# Altium project Carte_Batterie_PAMI 2024.PrjPcb
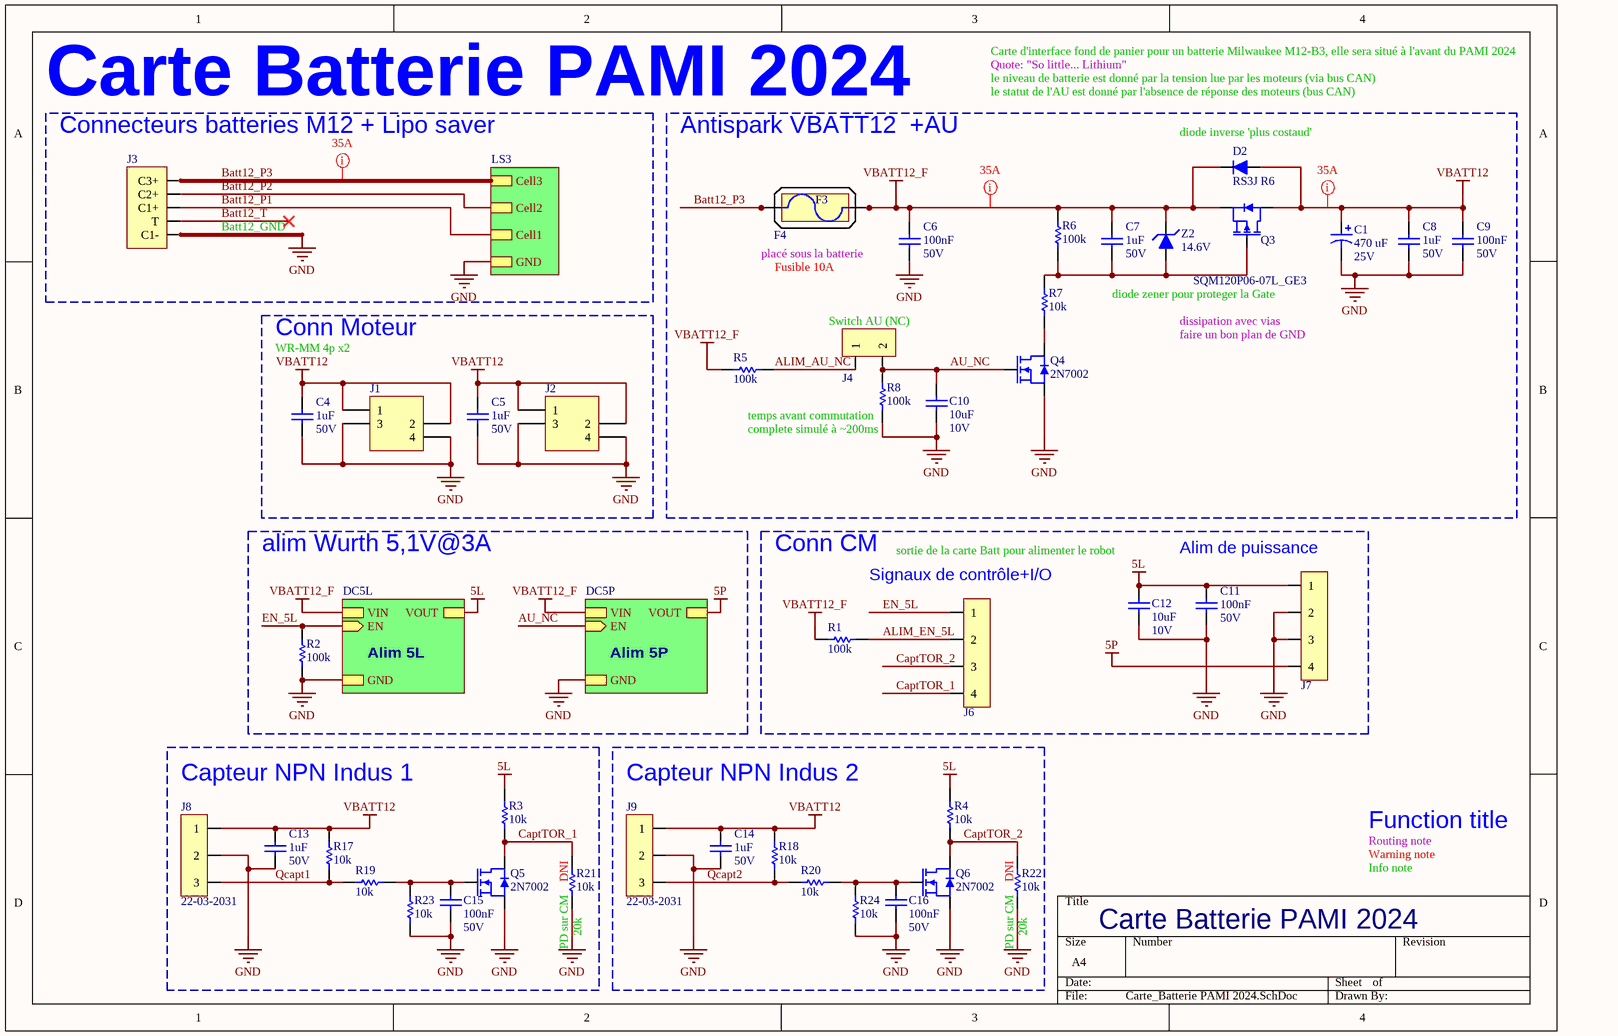
[diagram p0: Carte_Batterie PAMI 2024.SchDoc]
3 sheets, 88 parts. Net scope: hierarchical (ports join the sheet entries above them; power ports are global).
Board file: Carte_Batterie PAMI 2024.PcbDoc
Sheets:
  Carte_Batterie PAMI 2024.SchDoc
    LS3 = Lipo_Saver_Buzzer_only.SchDoc
    DC5L = PWR_5V_3A.SchDoc
    DC5P = PWR_5V_3A.SchDoc

## Sheet Carte_Batterie PAMI 2024.SchDoc
size A4; Author: Audran; CompanyName: Goldorak; Address1: Electrolab; Address2: 52 rue Paul Lescop; Address3: 92000 Nanterre; DocumentNumber: 1; SheetNumber: 1; SheetTotal: 3; ProjectName: Cartes_2017

### Parts
(Parts that share a designator on the sheet are numbered #1, #2 ... from top to bottom, then left to right.)
C1  470 uF  RatedVoltage: 25V  [WCAP-ATG8_8x11.5x3.5x0.5]
C4  1uF  RatedVoltage: 50V  [WCAP-CSGP_0805, 2x1.25x1.25]
C5  1uF  RatedVoltage: 50V  [WCAP-CSGP_0805, 2x1.25x1.25]
C6  100nF  RatedVoltage: 50V  [WCAP-CSGP_0603, 1.6x0.8x0.8]
C7  1uF  RatedVoltage: 50V  [WCAP-CSGP_0805, 2x1.25x1.25]
C8  1uF  RatedVoltage: 50V  [WCAP-CSGP_0805, 2x1.25x1.25]
C9  100nF  RatedVoltage: 50V  [WCAP-CSGP_0603, 1.6x0.8x0.8]
C10  10uF  RatedVoltage: 10V  [WCAP-CSGP_0805, 2x1.25x1.25]
C11  100nF  RatedVoltage: 50V  [WCAP-CSGP_0603, 1.6x0.8x0.8]
C12  10uF  RatedVoltage: 10V  [WCAP-CSGP_0805, 2x1.25x1.25]
C13  1uF  RatedVoltage: 50V  [WCAP-CSGP_0805, 2x1.25x1.25]
C14  1uF  RatedVoltage: 50V  [WCAP-CSGP_0805, 2x1.25x1.25]
C15  100nF  RatedVoltage: 50V  [WCAP-CSGP_0603, 1.6x0.8x0.8]
C16  100nF  RatedVoltage: 50V  [WCAP-CSGP_0603, 1.6x0.8x0.8]
D2  RS3J R6  [SMC, DO-214AB]
F3  0891030.NXS  (value not drawn)  (mechanical)
F4  3557-2  [3557-2]  (value not drawn)
J1  690367280476  [690367280476]  (value not drawn)
J2  690367280476  [690367280476]  (value not drawn)
J3  custom connector  [CONN_BATT-M12]  (value not drawn)
J4  22-03-2021  [Conn_22-03-2021]  (value not drawn)
J6  22-03-2041  [Conn_22-03-2041]  (value not drawn)
J7  22-03-2041  [Conn_22-03-2041]  (value not drawn)
J8  22-03-2031  [Conn_22-03-2031]
J9  22-03-2031  [Conn_22-03-2031]
Q3  SQM120P06-07L_GE3  [TO263AB, D2PAK]
Q4  2N7002  [SOT-23]
Q5  2N7002  [SOT-23]
Q6  2N7002  [SOT-23]
R1  value 100k  [RESC1608X06N]  (hidden comment: RC0603FR-07100KL)
R2  value 100k  [RESC1608X06N]  (hidden comment: RC0603FR-07100KL)
R3  value 10k  [RESC1608X06N]  (hidden comment: RC0603FR-0710KL)
R4  value 10k  [RESC1608X06N]  (hidden comment: RC0603FR-0710KL)
R5  value 100k  [RESC1608X06N]  (hidden comment: RC0603FR-07100KL)
R6  value 100k  [RESC1608X06N]  (hidden comment: RC0603FR-07100KL)
R7#1  value 10k  [RESC1608X06N]  (hidden comment: RC0603FR-0710KL)
R8#1  value 100k  [RESC1608X06N]  (hidden comment: RC0603FR-07100KL)
R17  value 10k  [RESC1608X06N]  (hidden comment: RC0603FR-0710KL)
R18  value 10k  [RESC1608X06N]  (hidden comment: RC0603FR-0710KL)
R19  value 10k  [RESC1608X06N]  (hidden comment: RC0603FR-0710KL)
R20  value 10k  [RESC1608X06N]  (hidden comment: RC0603FR-0710KL)
R21  value 10k  [RESC1608X06N]  (hidden comment: RC0603FR-0710KL)
R22  value 10k  [RESC1608X06N]  (hidden comment: RC0603FR-0710KL)
R23  value 10k  [RESC1608X06N]  (hidden comment: RC0603FR-0710KL)
R24  value 10k  [RESC1608X06N]  (hidden comment: RC0603FR-0710KL)
Z2  value 14.6V  [SOD-323]  (hidden comment: MM3Z15VST1G)

### Blocks framed on the sheet
Carte Batterie PAMI 2024: J3
Conn Moteur: C4 C5 J1 J2
alim Wurth 5,1V@3A: R2
Conn CM: C11 C12 J6 J7 R1
Capteur NPN Indus 1: C13 C15 J8 Q5 R3 R17 R19 R21 R23
Capteur NPN Indus 2: C14 C16 J9 Q6 R4 R18 R20 R22 R24

### Sub-sheets
DC5L = PWR_5V_3A.SchDoc: GND, EN (in), VIN, VOUT  | DeviceSheetTitle: Alim 5L
DC5P = PWR_5V_3A.SchDoc: GND, EN (in), VIN, VOUT  | DeviceSheetTitle: Alim 5P
LS3 = Lipo_Saver_Buzzer_only.SchDoc: Cell3, Cell2, Cell1, GND  | DeviceSheetTitle: Device Sheet Title

### Nets
5L: C11.2 C12.2 J7.1 R3.2 R4.2 ; sheet DC5L/VOUT
5P: J7.4 ; sheet DC5P/VOUT
GND: C1.2 C4.1 C5.1 C6.1 C8.1 C9.1 C10.1 C11.1 C12.1 C13.1 C14.1 C15.2 C16.2 J1.3 J1.4 J2.3 J2.4 J3.5(C1-) J7.2 J7.3 J8.2 J9.2 Q4.2(S) Q5.2(S) Q6.2(S) R2.1 R8#1.1 R21.1 R22.1 R23.1 R24.1 ; sheet LS3/GND, sheet DC5L/GND, sheet DC5P/GND
VBATT12: C1.1 C4.2 C5.2 C8.2 C9.2 C13.2 C14.2 D2.1 J1.1 J1.2 J2.1 J2.2 J8.1 J9.1 Q3.4(D) R17.2 R18.2
VBATT12_F: C6.2 C7.2 D2.2 F4.2 F4.4 Q3.3(S) R1.1 R5.1 R6.2 Z2.2 ; sheet DC5L/VIN, sheet DC5P/VIN
ALIM_AU_NC: J4.1 R5.2
ALIM_EN_5L: J6.2 R1.2
AU_NC: C10.2 J4.2 Q4.1(G) R8#1.2 ; sheet DC5P/EN
Batt12_P1: J3.3(C1+) ; sheet LS3/Cell1
Batt12_P2: J3.2(C2+) ; sheet LS3/Cell2
Batt12_P3: F4.1 F4.3 J3.1(C3+) ; sheet LS3/Cell3
Batt12_T: J3.4(T)
CaptTOR_1: J6.4 Q5.3(D) R3.1 R21.2
CaptTOR_2: J6.3 Q6.3(D) R4.1 R22.2
EN_5L: J6.1 R2.2 ; sheet DC5L/EN
Qcapt1: J8.3 R17.1 R19.1
Qcapt2: J9.3 R18.1 R20.1
NetC7_1: C7.1 Q3.1(G) R6.1 R7#1.2 Z2.1
NetC15_1: C15.1 Q5.1(G) R19.2 R23.2
NetC16_1: C16.1 Q6.1(G) R20.2 R24.2
NetQ4_3: Q4.3(D) R7#1.1

### Layout directives
net class PWR_35A: Batt12_P3, VBATT12, VBATT12_F

### Notes on the sheet
- Quote: "So little... Lithium"
- Carte d'interface fond de panier pour un batterie Milwaukee M12-B3, elle sera situé à l'avant du PAMI 2024
- le niveau de batterie est donné par la tension lue par les moteurs (via bus CAN)
- le statut de l'AU est donné par l'absence de réponse des moteurs (bus CAN)
- (near J3) Connecteurs batteries M12 + Lipo saver
- Antispark VBATT12
- +AU
- (near D2) diode inverse 'plus costaud'
- Batt12_GND
- (near C6) placé sous la batterie
- Fusible 10A
- diode zener pour proteger la Gate
- WR-MM 4p x2
- (near J4) Switch AU (NC)
- faire un bon plan de GND
- dissipation avec vias
- (near R8#1) temps avant commutation
- (near R8#1) complete simulé à ~200ms
- (near J6) Signaux de contrôle+I/O
- sortie de la carte Batt pour alimenter le robot
- Alim de puissance
- Routing note
- Function title
- (near R21) DNI
- (near R22) DNI
- Warning note
- Info note
- (near R21) PD sur CM
- (near R21) 20k
- (near R22) PD sur CM
- (near R22) 20k
- Carte Batterie PAMI 2024

### Library data of the parts
C1 = WCAP-ATG8, 860010474013: CAP Alu 470 UF 20% 25 V; Manufacturer: Wurth Elektronik; ComponentLink1Description: Datasheet; ComponentLink1URL: http://katalog.we-online.de/pbs/datasheet/860010474013.pdf; Manufacturer Part Number: 860010474013; Value: 470 uF; Size: 8mmx11.5mm
C4 C5 C7 C8 C13 C14 = WCAP-CSGP, 885012207103: CAP CER 1uF 50V X7R 0805; Manufacturer: Wurth Elektronik; ComponentLink1Description: Datasheet; ComponentLink1URL: http://katalog.we-online.com/pbs/datasheet/885012207103.pdf; Manufacturer Part Number: 885012207103; Value: 1uF; Size: 0805; CeramicType: X7R; Supplier 2: JLCPCB; Supplier Part Number 2: C28323; Supplier Footprint 2: 0805
C6 C9 C11 C15 C16 = WCAP-CSGP, 885012206095: CAP CER 100nF 50V X7R 0603; Manufacturer: Wurth Elektronik; ComponentLink1Description: Datasheet; ComponentLink1URL: http://katalog.we-online.com/pbs/datasheet/885012206095.pdf; Value: 100nF; Size: 0603; CeramicType: X7R; Manufacturer Part Number: 885012206095; Supplier 2: JLCPCB; Supplier Part Number 2: C14663; Supplier Footprint 2: 0603
C10 C12 = WCAP-CSGP, 885012207026: CAP CER 10uF 10V X7R 0805; Manufacturer: Wurth Elektronik; ComponentLink1Description: Datasheet; ComponentLink1URL: http://katalog.we-online.com/pbs/datasheet/885012207026.pdf; Manufacturer Part Number: 885012207026; Value: 10uF; Size: 0805; CeramicType: X7R; Supplier 1: Farnell; Supplier Part Number 1: 2495189; Supplier Part Number 2: C15850; Supplier 2: JLCPCB; Supplier Footprint 2: 0805
D2 = RS3J_R6: DIODE GEN PURP 600V 3A SMC; Manufacturer: TAIWAN SEMICONDUCTOR; Type: Standard; Manufacturer Part Number: RS3J R6; ContinuousForwardCurrent: 3A; Supplier 1: Farnell; Supplier Part Number 1: 2677388; ComponentLink1Description: Datasheet; ComponentLink1URL: http://www.farnell.com/datasheets/2182655.pdf; Value: 600V
F3 = 0891030.NXS: FUSE AUTO 30A 58VDC BLADE MINI; Manufacturer: Littelfuse Inc.; Manufacturer Part Number: 0891030.NXS; Supplier 1: Digi-Key; Supplier Part Number 1: F4993-ND; ComponentLink1URL: http://www.littelfuse.com/~/media/automotive/datasheets/fuses/passenger-car-and-commercial-vehicle/blade-fuses/littelfuse_lowprofilemini_datasheet.pdf; ComponentLink1Description: Datasheet; Value: 30A
F4 = 3557-2: FUSE Holder 500V 30A PCB; Manufacturer: Keystone Electronics; Value: na; Supplier 1: Farnell; Supplier Part Number 1: 2292904; Manufacturer Part Number: 3557-2; ComponentLink1URL: http://www.keyelco.com/product-pdf.cfm?p=296; ComponentLink1Description: Datasheet
J1 J2 = 690367280476: WR-MM 4p Female SMT Connector with Polarization; Manufacturer: Wurth Electronics Inc.; Value: 4; ComponentLink1Description: Datasheet; ComponentLink1URL: http://katalog.we-online.de/em/datasheet/69036728xx76.pdf; Manufacturer Part Number: 690367280476; Supplier 1: Farnell; Supplier Part Number 1: 1641848
J3 = CONN_BATT-M12: Batterie connector for Milwaukee M12, use 2x RS 125-2006 and 3x RS 125-2000
J4 = 22-03-2021: CONN HEADER VERT 2POS 2.54MM; Manufacturer: MOLEX; Supplier 1: Farnell; Supplier Part Number 1: 9731075; Manufacturer Part Number: 22-03-2021; ComponentLink1URL: http://www.farnell.com/datasheets/1791308.pdf; ComponentLink1Description: Datasheet; ComponentLink2URL: http://www.farnell.com/cad/495071.pdf  http://www.farnell.com/cad/1533907.pdf  http://www.farnell.com/cad/1533907.pdf; ComponentLink2Description: Drawings
J6 J7 = Conn_22-03-2041: CONN HEADER VERT 4POS 2.54MM; Manufacturer: MOLEX; Manufacturer Part Number: 22-03-2041; Supplier 1: Farnell; Supplier Part Number 1: 9731091; ComponentLink1Description: Datasheet; ComponentLink1URL: https://www.molex.com/pdm_docs/sd/022032041_sd.pdf
J8 J9 = 22-03-2031: CONN HEADER VERT 3POS 2.54MM; Manufacturer: MOLEX; Supplier 1: Farnell; Supplier Part Number 1: 9731083; Manufacturer Part Number: 22-03-2031; ComponentLink1URL: http://www.farnell.com/datasheets/1785732.pdf; ComponentLink1Description: Datasheet; ComponentLink2URL: http://www.farnell.com/cad/495071.pdf  http://www.farnell.com/cad/1533907.pdf  http://www.farnell.com/cad/1533907.pdf; ComponentLink2Description: Drawings
Q3 = SQM120P06-07L_GE3: MOSFET P 60V 120A D2PAK; Manufacturer: VISHAY; Manufacturer Part Number: SQM120P06-07L_GE3; ComponentLink1Description: Datasheet; ComponentLink1URL: http://www.vishay.com/docs/67026/sqm120p0.pdf; Supplier 1: Farnell; Supplier Part Number 1: 2617099
Q4-Q6 = 2N7002: MOSFET N 60V 115MA SOT23; Manufacturer: Changjiang Electronics Tech (CJ); Manufacturer Part Number: 2N7002; ComponentLink1Description: Datasheet; ComponentLink1URL: https://datasheet.lcsc.com/szlcsc/1810151612_Changjiang-Electronics-Tech-CJ-2N7002_C8545.pdf; Supplier 2: JLCPCB; Supplier Part Number 2: C8545; Supplier 1: Farnell; Supplier Part Number 1: 1510761; Supplier Footprint 2: SOT-23-3
R1 R2 R5 R6 R8#1 = RC0603FR-07100KL: RES SMD 100K OHM 1% 1/10W 0603; Manufacturer: Yageo; Power: 100mW; Vmax: 50V; Manufacturer Part Number: RC0603FR-07100KL; Type: Thick Film; ComponentLink1Description: Manufacturer; ComponentLink1URL: http://www.yageo.com/NewPortal/_en/index.jsp; ComponentLink2Description: Datasheet; ComponentLink2URL: http://www.farnell.com/datasheets/2167052.pdf; Supplier 1: Farnell; Supplier Part Number 1: 2309107; Precision: ±1%; Supplier 2: JLCPCB; Supplier Part Number 2: C25803; Supplier Footprint 2: 0603
R3 R4 R7#1 R17-R24 = RC0603FR-0710KL: RES SMD 10K OHM 1% 1/10W 0603; Manufacturer: Yageo; Power: 100mW; Vmax: 50V; Manufacturer Part Number: RC0603FR-0710KL; Type: Thick Film; ComponentLink1Description: Manufacturer; ComponentLink1URL: http://www.yageo.com/NewPortal/_en/index.jsp; ComponentLink2Description: Datasheet; ComponentLink2URL: http://www.farnell.com/datasheets/2167052.pdf; Supplier 1: Farnell; Supplier Part Number 1: 9238603; Precision: ±1%; Supplier 2: JLCPCB; Supplier Part Number 2: C25804; Supplier Footprint 2: 0603
Z2 = MM3Z15VST1G: DIODE ZENER 14.6V 300mW SOD323; Manufacturer: ON Semiconductor; Manufacturer Part Number: MM3Z15VST1G; ComponentLink1URL: http://www.farnell.com/datasheets/2028649.pdf; ComponentLink1Description: Datasheet; Supplier 1: Farnell; Supplier Part Number 1: 2533369; Type: Zener

## Sheet Lipo_Saver_Buzzer_only.SchDoc
size A4; Author: Audran; CompanyName: Goldorak; Address1: Electrolab; Address2: 52 rue Paul Lescop; Address3: 92000 Nanterre; DocumentNumber: 3; SheetNumber: 3; SheetTotal: 3; ProjectName: Cartes_2017
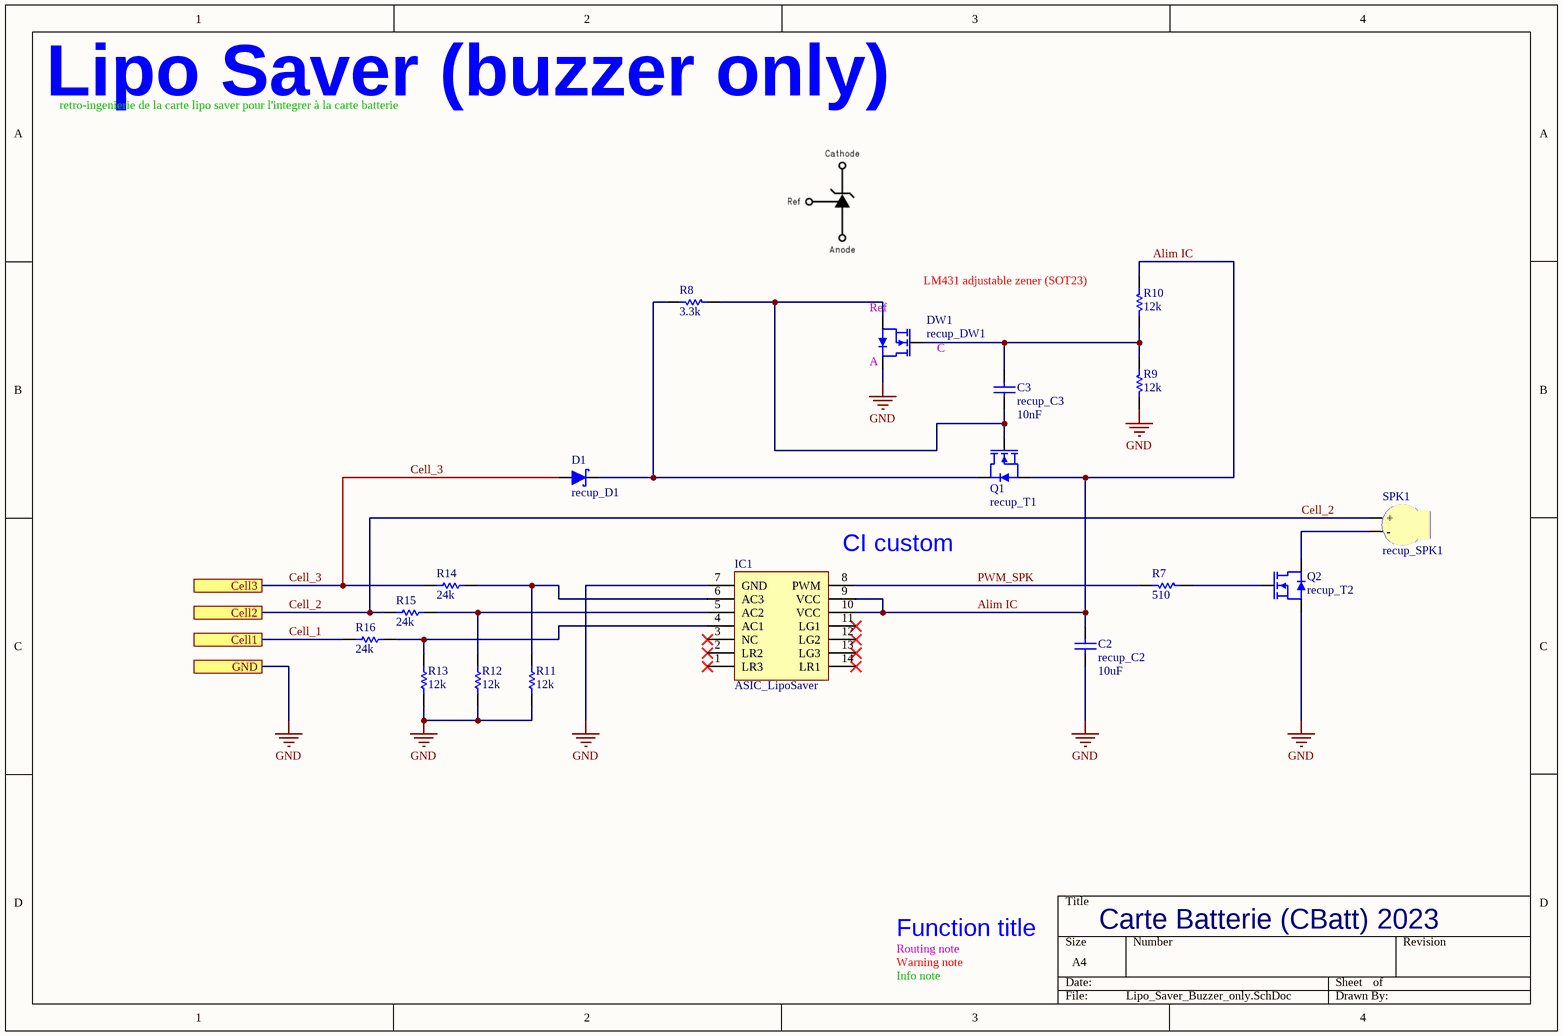
[diagram p1: Lipo_Saver_Buzzer_only.SchDoc]

### Parts
(Parts that share a designator on the sheet are numbered #1, #2 ... from top to bottom, then left to right.)
C2  recup_C2  value 10uF  [WCAP-CSGP_0805, 2x1.25x1.25]
C3  recup_C3  value 10nF  [WCAP-CSGP_0603, 1.6x0.8x0.8]
D1  recup_D1  [SOD-123FL]
DW1  recup_DW1  [SOT-23]
IC1  ASIC_LipoSaver  [SOIC127P600X175-14N]
Q1  recup_T1  [SOT-23]
Q2  recup_T2  [SOT-23]
R7#2  value 510  [RESC1608X06N]  (hidden comment: RC0603FR-07100KL)
R8#2  value 3.3k  [RESC1608X06N]  (hidden comment: RC0603FR-07100KL)
R9  value 12k  [RESC1608X06N]  (hidden comment: RC0603FR-07100KL)
R10  value 12k  [RESC1608X06N]  (hidden comment: RC0603FR-07100KL)
R11  value 12k  [RESC1608X06N]  (hidden comment: RC0603FR-07100KL)
R12  value 12k  [RESC1608X06N]  (hidden comment: RC0603FR-07100KL)
R13  value 12k  [RESC1608X06N]  (hidden comment: RC0603FR-07100KL)
R14  value 24k  [RESC1608X06N]  (hidden comment: RC0603FR-07100KL)
R15  value 24k  [RESC1608X06N]  (hidden comment: RC0603FR-07100KL)
R16  value 24k  [RESC1608X06N]  (hidden comment: RC0603FR-07100KL)
SPK1  recup_SPK1  [BUZZER_LipoSaver]

### Ports
Cell1, Cell2, Cell3, GND

### Nets
GND: C2.1 DW1.3(D) IC1.7(GND) Q2.2(S) R9.2 R11.1 R12.1 R13.1 ; port GND
Alim IC: C2.2 IC1.9(VCC) IC1.10(VCC) Q1.2(S) R10.2
Cell_1: R16.2 ; port Cell1  [project net Batt12_P1]
Cell_2: R15.2 SPK1.1(+) ; port Cell2  [project net Batt12_P2]
Cell_3: D1.1 R14.2 ; port Cell3  [project net Batt12_P3]
PWM_SPK: IC1.8(PWM) R7#2.1
NetC3_1: C3.1 DW1.2(S) Q1.1(G) R8#2.2
NetC3_2: C3.2 DW1.1(G) R9.1 R10.1
NetD1_2: D1.2 Q1.3(D) R8#2.1
NetIC1_4: IC1.4(AC1) R13.2 R16.1
NetIC1_5: IC1.5(AC2) R12.2 R15.1
NetIC1_6: IC1.6(AC3) R11.2 R14.1
NetQ2_1: Q2.1(G) R7#2.2
NetQ2_3: Q2.3(D) SPK1.2(-)

Not connected (* = marked no-connect by the designer): IC1 1(LR3)* 2(LR2)* 3(NC)* 11(LG1)* 12(LG2)* 13(LG3)* 14(LR1)*

### Notes on the sheet
- Lipo Saver (buzzer only)
- retro-ingenierie de la carte lipo saver pour l'integrer à la carte batterie
- (near DW1) Ref
- LM431 adjustable zener (SOT23)
- (near DW1) A
- (near DW1) C
- (near IC1) CI custom
- Routing note
- Warning note
- Info note
- Function title
- Carte Batterie (CBatt) 2023

### Library data of the parts
C2 = WCAP-CSGP, 885012207103: as C4 on sheet Carte_Batterie PAMI 2024; ComponentLink1Description: Datasheet; ComponentLink1URL: http://katalog.we-online.com/pbs/datasheet/885012207103.pdf; Manufacturer Part Number: 885012207103; Size: 0805; CeramicType: X7R; Supplier 2: JLCPCB; Supplier Part Number 2: C28323; RatedVoltage: 50V; Supplier Footprint 2: 0805; Supplier 1: Farnell; Supplier Part Number 1: 2495200
C3 = WCAP-CSGP, 885012206095: as C6 on sheet Carte_Batterie PAMI 2024; ComponentLink1Description: Datasheet; ComponentLink1URL: http://katalog.we-online.com/pbs/datasheet/885012206095.pdf; Size: 0603; CeramicType: X7R; RatedVoltage: 50V; Manufacturer Part Number: 885012206095; Supplier 2: JLCPCB; Supplier Part Number 2: C14663; Supplier Footprint 2: 0603
D1 = RBR3MM40ATFTR: DIODE SCHOTTKY 40V 3A SOD123-FL; Manufacturer: ROHM; Supplier 1: Farnell; Manufacturer Part Number: RBR3MM40ATFTR; ComponentLink1URL: http://www.farnell.com/datasheets/2067190.pdf; ComponentLink1Description: Datasheet; Supplier Part Number 1: 2581593; ComponentLink2Description: Manufacturer; ComponentLink2URL: http://www.rohm.com/web/global/products/-/product/RBR3MM40ATF; ContinuousForwardCurrent: 3A; Type: Schottky; Supplier 2: JLCPCB; Supplier Part Number 2: C8598; Value: 40V; Supplier Footprint 2: SOD-123
DW1 Q1 Q2 = 2N7002: as Q4 on sheet Carte_Batterie PAMI 2024; Manufacturer Part Number: 2N7002; ComponentLink1Description: Datasheet; ComponentLink1URL: https://datasheet.lcsc.com/szlcsc/1810151612_Changjiang-Electronics-Tech-CJ-2N7002_C8545.pdf; Supplier 2: JLCPCB; Supplier Part Number 2: C8545; Supplier 1: Farnell; Supplier Part Number 1: 1510761; Supplier Footprint 2: SOT-23-3
IC1 = ASIC_LipoSaver: Specific IC for Lipo Saver (extracted; Manufacturer: LipoSaver; ComponentLink1URL: https://www.onsemi.com/pdf/datasheet/74vhc02-d.pdf; ComponentLink1Description: Datasheet; Manufacturer Part Number: ASIC_LipoSaver
R7#2 R8#2 R9-R16 = RC0603FR-07100KL: as R1 on sheet Carte_Batterie PAMI 2024; Manufacturer Part Number: RC0603FR-07100KL; Type: Thick Film; ComponentLink1Description: Manufacturer; ComponentLink1URL: http://www.yageo.com/NewPortal/_en/index.jsp; ComponentLink2Description: Datasheet; ComponentLink2URL: http://www.farnell.com/datasheets/2167052.pdf; Supplier 1: Farnell; Supplier Part Number 1: 2309107; Precision: ±1%; Supplier 2: JLCPCB; Supplier Part Number 2: C25803; Supplier Footprint 2: 0603
SPK1 = BUZZER_LipoSaver: Cavalier soudure "ouvert" + empreinte dipole 0603

## Sheet PWR_5V_3A.SchDoc
size A4; Author: Audran; CompanyName: Goldorak; Address1: Electrolab; Address2: 52 rue Paul Lescop; Address3: 92000 Nanterre; DocumentNumber: 2; SheetNumber: 2; SheetTotal: 3; ProjectName: Cartes_2017
Used 2 times, as channels DC5L, DC5P. Parts and nets are listed once, with the designators drawn on the sheet.
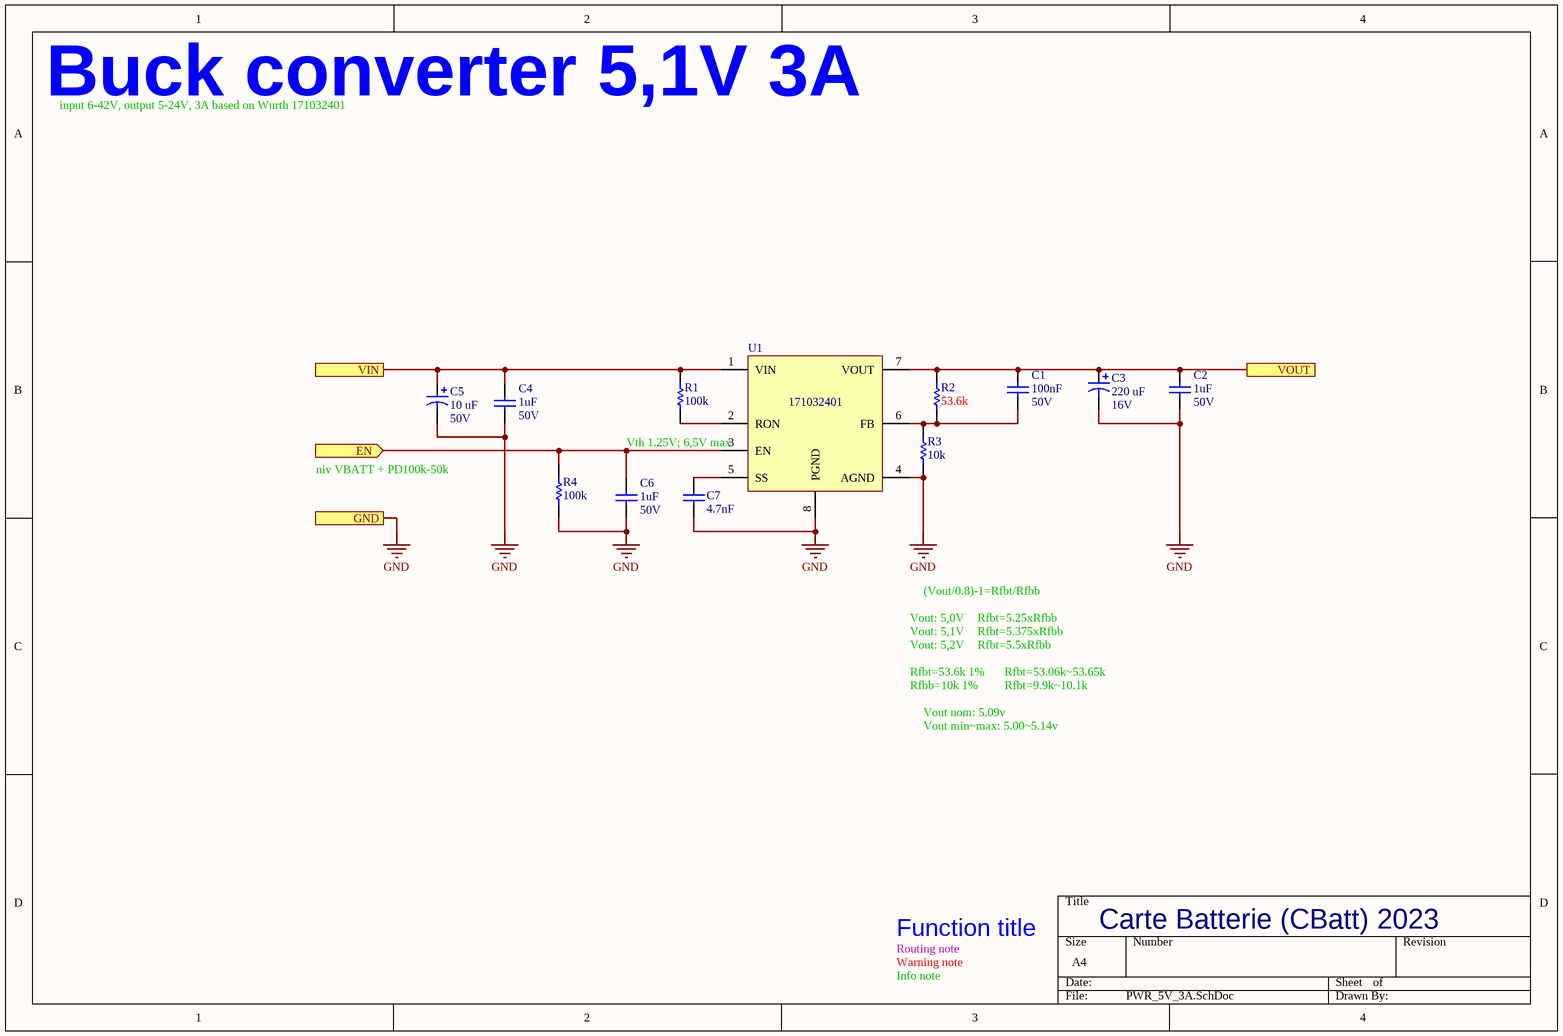
[diagram p2: PWR_5V_3A.SchDoc]

### Parts
C1  100nF  RatedVoltage: 50V  [WCAP-CSGP_0603, 1.6x0.8x0.8]
C2  1uF  RatedVoltage: 50V  [WCAP-CSGP_0805, 2x1.25x1.25]
C3  220 uF  RatedVoltage: 16V  [WCAP-ATG8_6.3x11x2.5x0.5]
C4  1uF  RatedVoltage: 50V  [WCAP-CSGP_0805, 2x1.25x1.25]
C5  10 uF  RatedVoltage: 50V  [WCAP-ATG8_5x11x2x0.5]
C6  1uF  RatedVoltage: 50V  [WCAP-CSGP_0805, 2x1.25x1.25]
C7  4.7nF  [WCAP-CSGP_0603, 1.6x0.8x0.8]
R1  value 100k  [RESC1608X06N]  (hidden comment: RC0603FR-07100KL)
R2  value 53.6k  [RESC1608X06N]  (hidden comment: RC0603FR-0710KL)
R3  value 10k  [RESC1608X06N]  (hidden comment: RC0603FR-0710KL)
R4  value 100k  [RESC1608X06N]  (hidden comment: RC0603FR-07100KL)
U1  171032401  [WPME-VDRM_TO263-7EP]

### Ports
EN (in), GND, VIN, VOUT

### Nets
GND: C2.1 C3.2 C4.1 C5.2 C6.1 C7.1 R3.1 R4.1 U1.4(AGND) U1.8(PGND) ; port GND
EN: C6.2 R4.2 U1.3(EN) ; port EN
VIN: C4.2 C5.1 R1.2 U1.1(VIN) ; port VIN
VOUT: C1.2 C2.2 C3.1 R2.2 U1.7(VOUT) ; port VOUT
NetC1_1: C1.1 R2.1 R3.2 U1.6(FB)
NetC7_2: C7.2 U1.5(SS)
NetR1_1: R1.1 U1.2(RON)

### Channels
DC5L: designators end in _DC5L; ports EN=EN_5L GND=GND VIN=VBATT12_F VOUT=5L
DC5P: designators end in _DC5P; ports EN=AU_NC GND=GND VIN=VBATT12_F VOUT=5P

### Notes on the sheet
- Buck converter 5,1V 3A
- input 6-42V, output 5-24V, 3A based on Wurth 171032401
- (near U1) Vth 1.25V; 6,5V max
- niv VBATT + PD100k-50k
- Vout: 5,1V
- Vout: 5,2V
- Vout: 5,0V
- (Vout/0.8)-1=Rfbt/Rfbb
- Rfbt=5.375xRfbb
- Rfbt=5.5xRfbb
- Rfbt=5.25xRfbb
- Rfbt=53.6k 1%
- Rfbb=10k 1%
- Vout nom: 5.09v
- Rfbt=53.06k~53.65k
- Rfbt=9.9k~10.1k
- Vout min~max: 5.00~5.14v
- Routing note
- Warning note
- Info note
- Function title
- Carte Batterie (CBatt) 2023

### Library data of the parts
C1 = WCAP-CSGP, 885012206095: as C6 on sheet Carte_Batterie PAMI 2024; ComponentLink1Description: Datasheet; ComponentLink1URL: http://katalog.we-online.com/pbs/datasheet/885012206095.pdf; Value: 100nF; Size: 0603; CeramicType: X7R; Manufacturer Part Number: 885012206095; Supplier 2: JLCPCB; Supplier Part Number 2: C14663; Supplier Footprint 2: 0603
C2 C4 C6 = WCAP-CSGP, 885012207103: as C4 on sheet Carte_Batterie PAMI 2024; ComponentLink1Description: Datasheet; ComponentLink1URL: http://katalog.we-online.com/pbs/datasheet/885012207103.pdf; Manufacturer Part Number: 885012207103; Value: 1uF; Size: 0805; CeramicType: X7R; Supplier 2: JLCPCB; Supplier Part Number 2: C28323; Supplier Footprint 2: 0805
C3 = WCAP-ATG8, 860010373010: CAP Alu 220 UF 20% 16 V; Manufacturer: Wurth Elektronik; ComponentLink1Description: Datasheet; ComponentLink1URL: http://katalog.we-online.de/pbs/datasheet/860010373010.pdf; Manufacturer Part Number: 860010373010; Value: 220 uF; Size: 6.3mmx11mm
C5 = WCAP-ATG8, 860010672009: CAP Alu 10 UF 20% 50 V; Manufacturer: Wurth Elektronik; ComponentLink1Description: Datasheet; ComponentLink1URL: http://katalog.we-online.de/pbs/datasheet/860010672009.pdf; Manufacturer Part Number: 860010672009; Value: 10 uF; Size: 5mmx11mm
C7 = WCAP-CSGP, 885012206087: CAP CER 4.7nF 50V X7R 0603; Manufacturer: Wurth Elektronik; ComponentLink1Description: Datasheet; ComponentLink1URL: http://katalog.we-online.com/pbs/datasheet/885012206087.pdf; Manufacturer Part Number: 885012206087; Value: 4.7nF; Size: 0603; CeramicType: X7R; RatedVoltage: 50V; Supplier 2: JLCPCB; Supplier Part Number 2: C53987; Supplier Footprint 2: 0603; Supplier 1: Farnell; Supplier Part Number 1: 2495180
R1 R4 = RC0603FR-07100KL: as R1 on sheet Carte_Batterie PAMI 2024; Manufacturer Part Number: RC0603FR-07100KL; Type: Thick Film; ComponentLink1Description: Manufacturer; ComponentLink1URL: http://www.yageo.com/NewPortal/_en/index.jsp; ComponentLink2Description: Datasheet; ComponentLink2URL: http://www.farnell.com/datasheets/2167052.pdf; Supplier 1: Farnell; Supplier Part Number 1: 2309107; Precision: ±1%; Supplier 2: JLCPCB; Supplier Part Number 2: C25803; Supplier Footprint 2: 0603
R2 R3 = RC0603FR-0710KL: as R3 on sheet Carte_Batterie PAMI 2024; Manufacturer Part Number: RC0603FR-0710KL; Type: Thick Film; ComponentLink1Description: Manufacturer; ComponentLink1URL: http://www.yageo.com/NewPortal/_en/index.jsp; ComponentLink2Description: Datasheet; ComponentLink2URL: http://www.farnell.com/datasheets/2167052.pdf; Supplier 1: Farnell; Supplier Part Number 1: 9238603; Precision: ±1%; Supplier 2: JLCPCB; Supplier Footprint 2: 0603
  R3: Supplier Part Number 2: C25804
U1 = 171032401: WPME-VDRM DCDC 6-42Vin, 5-24Vout, 3Aout TO263-7EP; Manufacturer: Wurth Elektronik; Manufacturer Part Number: 171032401; ComponentLink1Description: Website Link; ComponentLink1URL: https://www.we-online.com/redexpert/article/171032401?ad; ComponentLink2Description: Datasheet Link; ComponentLink2URL: https://www.we-online.com/redexpert/spec/171032401?ad; Supplier 1: Farnell; Supplier Part Number 1: 2505849

## Nets that join several sheets
5L: Carte_Batterie PAMI 2024 (5 pins), DC5L (5 pins)
5P: Carte_Batterie PAMI 2024 (J7.4), DC5P (5 pins)
GND: Carte_Batterie PAMI 2024 (31 pins), Lipo_Saver_Buzzer_only (8 pins), DC5L (10 pins), DC5P (10 pins)
VBATT12_F: Carte_Batterie PAMI 2024 (10 pins), DC5L (C4_DC5L.2 C5_DC5L.1 R1_DC5L.2 U1_DC5L.1), DC5P (C4_DC5P.2 C5_DC5P.1 R1_DC5P.2 U1_DC5P.1)
AU_NC: Carte_Batterie PAMI 2024 (C10.2 J4.2 Q4.1 R8#1.2), DC5P (C6_DC5P.2 R4_DC5P.2 U1_DC5P.3)
Batt12_P1: Carte_Batterie PAMI 2024 (J3.3), Lipo_Saver_Buzzer_only (R16.2)
Batt12_P2: Carte_Batterie PAMI 2024 (J3.2), Lipo_Saver_Buzzer_only (R15.2 SPK1.1)
Batt12_P3: Carte_Batterie PAMI 2024 (F4.1 F4.3 J3.1), Lipo_Saver_Buzzer_only (D1.1 R14.2)
EN_5L: Carte_Batterie PAMI 2024 (J6.1 R2.2), DC5L (C6_DC5L.2 R4_DC5L.2 U1_DC5L.3)

## Assembly variants
PROD: not fitted C2 C4 C5 C6 C7 J1 J2 J2 J3 R23 R24